# EAGLE design moja-row (EAGLE 6.4)
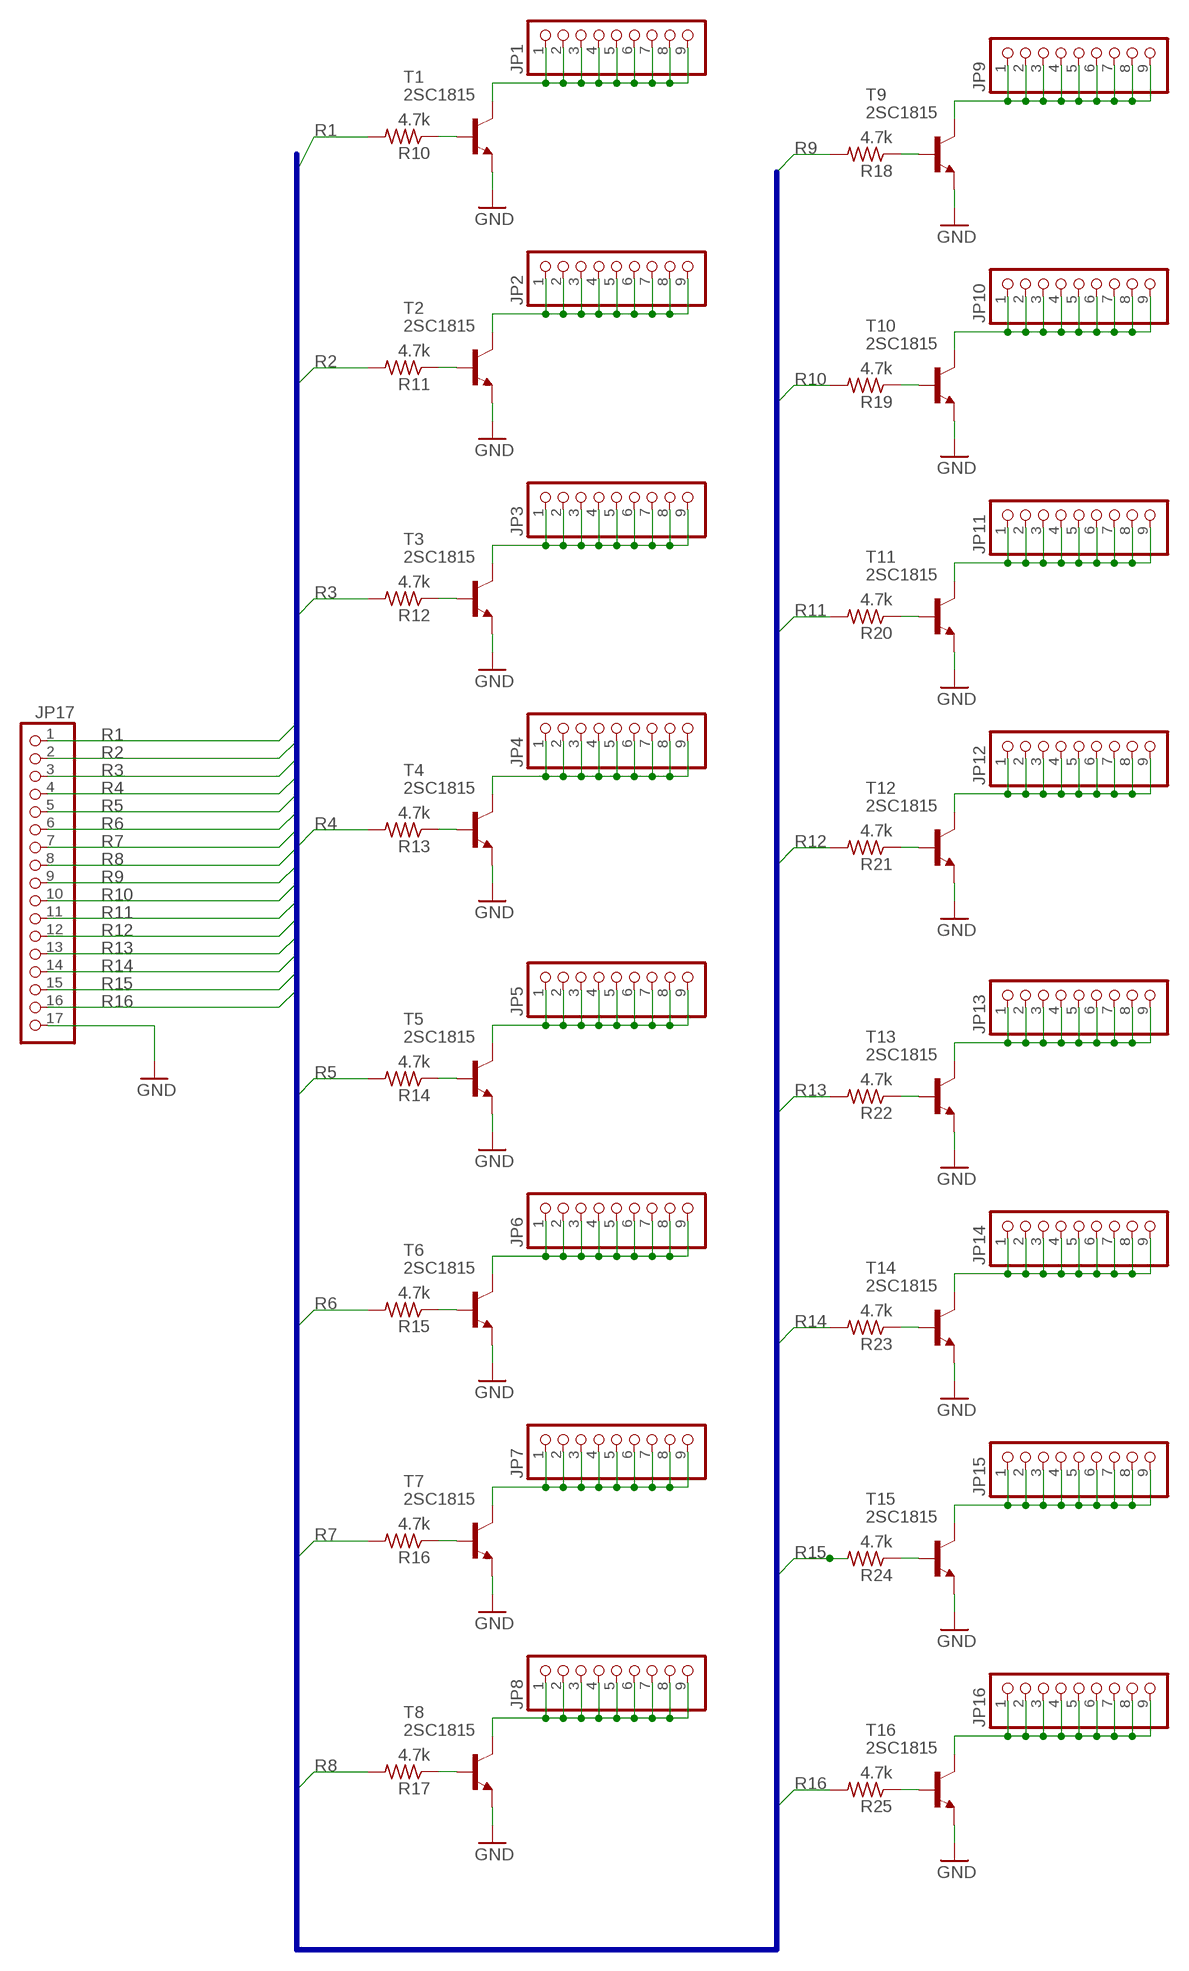
[diagram p0: schematic, sheet 1]

## Parts
JP1  PINHD-1X9  [1X09]
JP2  PINHD-1X9  [1X09]
JP3  PINHD-1X9  [1X09]
JP4  PINHD-1X9  [1X09]
JP5  PINHD-1X9  [1X09]
JP6  PINHD-1X9  [1X09]
JP7  PINHD-1X9  [1X09]
JP8  PINHD-1X9  [1X09]
JP9  PINHD-1X9  [1X09]
JP10  PINHD-1X9  [1X09]
JP11  PINHD-1X9  [1X09]
JP12  PINHD-1X9  [1X09]
JP13  PINHD-1X9  [1X09]
JP14  PINHD-1X9  [1X09]
JP15  PINHD-1X9  [1X09]
JP16  PINHD-1X9  [1X09]
JP17  PINHD-1X17  [1X17]
R10  4.7k  R-US_0204/2V  [0204V]
R11  4.7k  R-US_0204/2V  [0204V]
R12  4.7k  R-US_0204/2V  [0204V]
R13  4.7k  R-US_0204/2V  [0204V]
R14  4.7k  R-US_0204/2V  [0204V]
R15  4.7k  R-US_0204/2V  [0204V]
R16  4.7k  R-US_0204/2V  [0204V]
R17  4.7k  R-US_0204/2V  [0204V]
R18  4.7k  R-US_0204/2V  [0204V]
R19  4.7k  R-US_0204/2V  [0204V]
R20  4.7k  R-US_0204/2V  [0204V]
R21  4.7k  R-US_0204/2V  [0204V]
R22  4.7k  R-US_0204/2V  [0204V]
R23  4.7k  R-US_0204/2V  [0204V]
R24  4.7k  R-US_0204/2V  [0204V]
R25  4.7k  R-US_0204/2V  [0204V]
T1  2SC1815  [TO92-ECB]
T2  2SC1815  [TO92-ECB]
T3  2SC1815  [TO92-ECB]
T4  2SC1815  [TO92-ECB]
T5  2SC1815  [TO92-ECB]
T6  2SC1815  [TO92-ECB]
T7  2SC1815  [TO92-ECB]
T8  2SC1815  [TO92-ECB]
T9  2SC1815  [TO92-ECB]
T10  2SC1815  [TO92-ECB]
T11  2SC1815  [TO92-ECB]
T12  2SC1815  [TO92-ECB]
T13  2SC1815  [TO92-ECB]
T14  2SC1815  [TO92-ECB]
T15  2SC1815  [TO92-ECB]
T16  2SC1815  [TO92-ECB]

## Nets
GND: JP17.17 T1.E T2.E T3.E T4.E T5.E T6.E T7.E T8.E T9.E T10.E T11.E T12.E T13.E T14.E T15.E T16.E
N$19: JP1.1 JP1.2 JP1.3 JP1.4 JP1.5 JP1.6 JP1.7 JP1.8 JP1.9 T1.C
N$20: R10.1 T1.B
N$21: JP2.1 JP2.2 JP2.3 JP2.4 JP2.5 JP2.6 JP2.7 JP2.8 JP2.9 T2.C
N$22: R11.1 T2.B
N$23: JP3.1 JP3.2 JP3.3 JP3.4 JP3.5 JP3.6 JP3.7 JP3.8 JP3.9 T3.C
N$24: R12.1 T3.B
N$25: JP4.1 JP4.2 JP4.3 JP4.4 JP4.5 JP4.6 JP4.7 JP4.8 JP4.9 T4.C
N$26: R13.1 T4.B
N$27: JP5.1 JP5.2 JP5.3 JP5.4 JP5.5 JP5.6 JP5.7 JP5.8 JP5.9 T5.C
N$28: R14.1 T5.B
N$29: JP6.1 JP6.2 JP6.3 JP6.4 JP6.5 JP6.6 JP6.7 JP6.8 JP6.9 T6.C
N$30: R15.1 T6.B
N$31: JP7.1 JP7.2 JP7.3 JP7.4 JP7.5 JP7.6 JP7.7 JP7.8 JP7.9 T7.C
N$32: R16.1 T7.B
N$33: JP8.1 JP8.2 JP8.3 JP8.4 JP8.5 JP8.6 JP8.7 JP8.8 JP8.9 T8.C
N$34: R17.1 T8.B
N$35: JP9.1 JP9.2 JP9.3 JP9.4 JP9.5 JP9.6 JP9.7 JP9.8 JP9.9 T9.C
N$36: R18.1 T9.B
N$37: JP10.1 JP10.2 JP10.3 JP10.4 JP10.5 JP10.6 JP10.7 JP10.8 JP10.9 T10.C
N$38: R19.1 T10.B
N$39: JP11.1 JP11.2 JP11.3 JP11.4 JP11.5 JP11.6 JP11.7 JP11.8 JP11.9 T11.C
N$40: R20.1 T11.B
N$41: JP12.1 JP12.2 JP12.3 JP12.4 JP12.5 JP12.6 JP12.7 JP12.8 JP12.9 T12.C
N$42: R21.1 T12.B
N$43: JP13.1 JP13.2 JP13.3 JP13.4 JP13.5 JP13.6 JP13.7 JP13.8 JP13.9 T13.C
N$44: R22.1 T13.B
N$45: JP14.1 JP14.2 JP14.3 JP14.4 JP14.5 JP14.6 JP14.7 JP14.8 JP14.9 T14.C
N$46: R23.1 T14.B
N$47: JP15.1 JP15.2 JP15.3 JP15.4 JP15.5 JP15.6 JP15.7 JP15.8 JP15.9 T15.C
N$48: R24.1 T15.B
N$49: JP16.1 JP16.2 JP16.3 JP16.4 JP16.5 JP16.6 JP16.7 JP16.8 JP16.9 T16.C
N$50: R25.1 T16.B
R1: JP17.1 R10.2
R2: JP17.2 R11.2
R3: JP17.3 R12.2
R4: JP17.4 R13.2
R5: JP17.5 R14.2
R6: JP17.6 R15.2
R7: JP17.7 R16.2
R8: JP17.8 R17.2
R9: JP17.9 R18.2
R10: JP17.10 R19.2
R11: JP17.11 R20.2
R12: JP17.12 R21.2
R13: JP17.13 R22.2
R14: JP17.14 R23.2
R15: JP17.15 R24.2
R16: JP17.16 R25.2

## Buses
R[1..16]

## Library data of the parts
JP1-JP16 = pinhead:PINHD-1X9: PIN HEADER
JP17 = pinhead:PINHD-1X17: PIN HEADER
R10-R25 = resistor:R-US_: RESISTOR, American symbol
T1-T16 = transistor:2SC1815: NPN EPITAXIAL TRANSISTOR Source: TOSHIBA .. 2SC1815 1.pdf

## Board
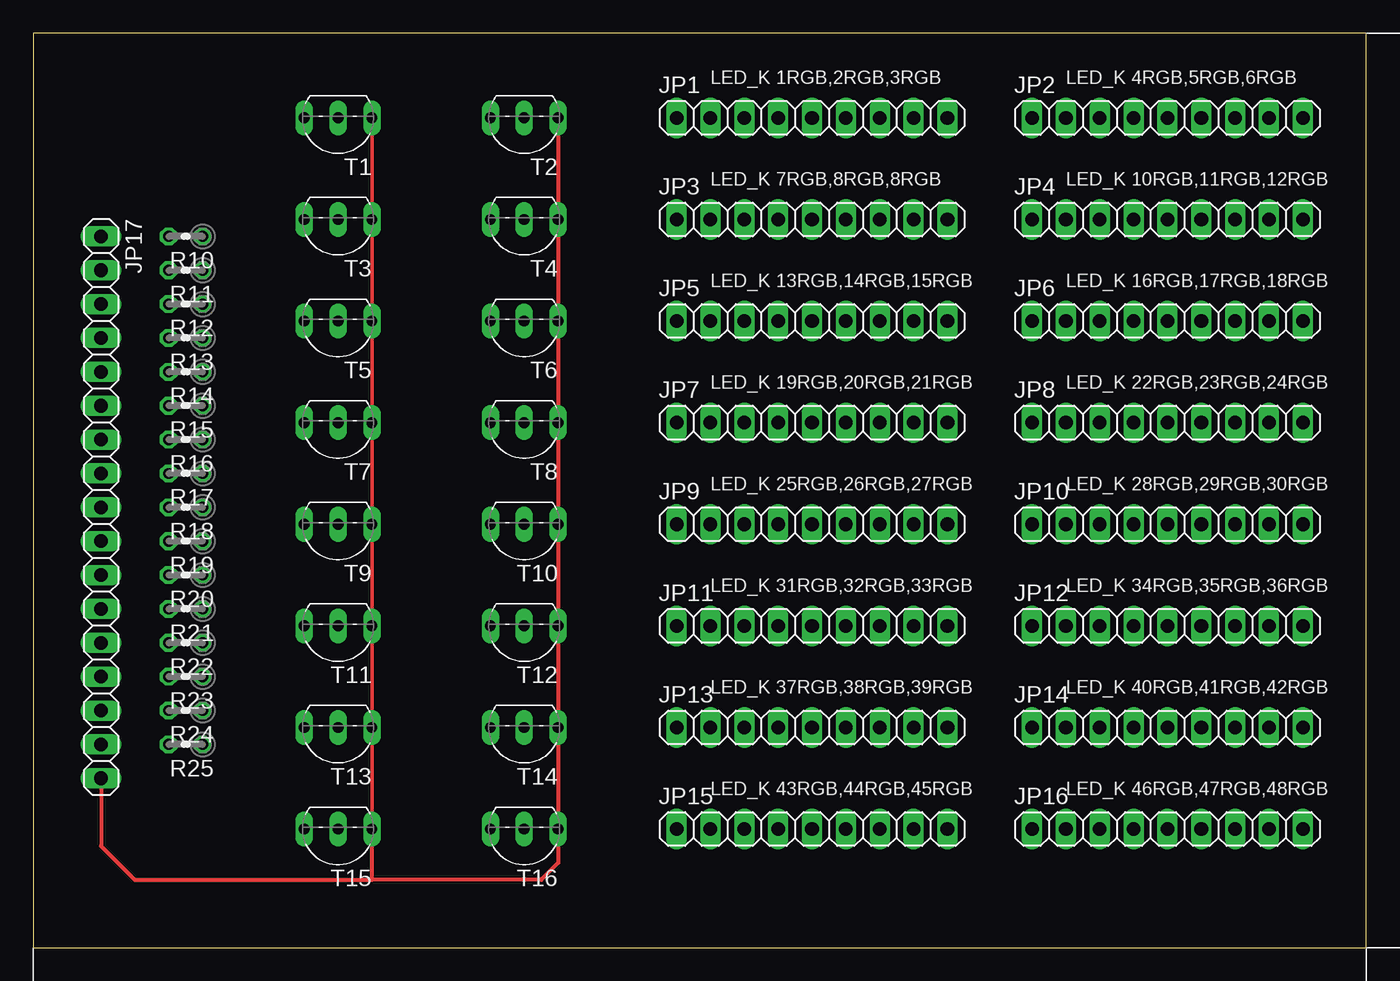
[diagram p1: board, top side]
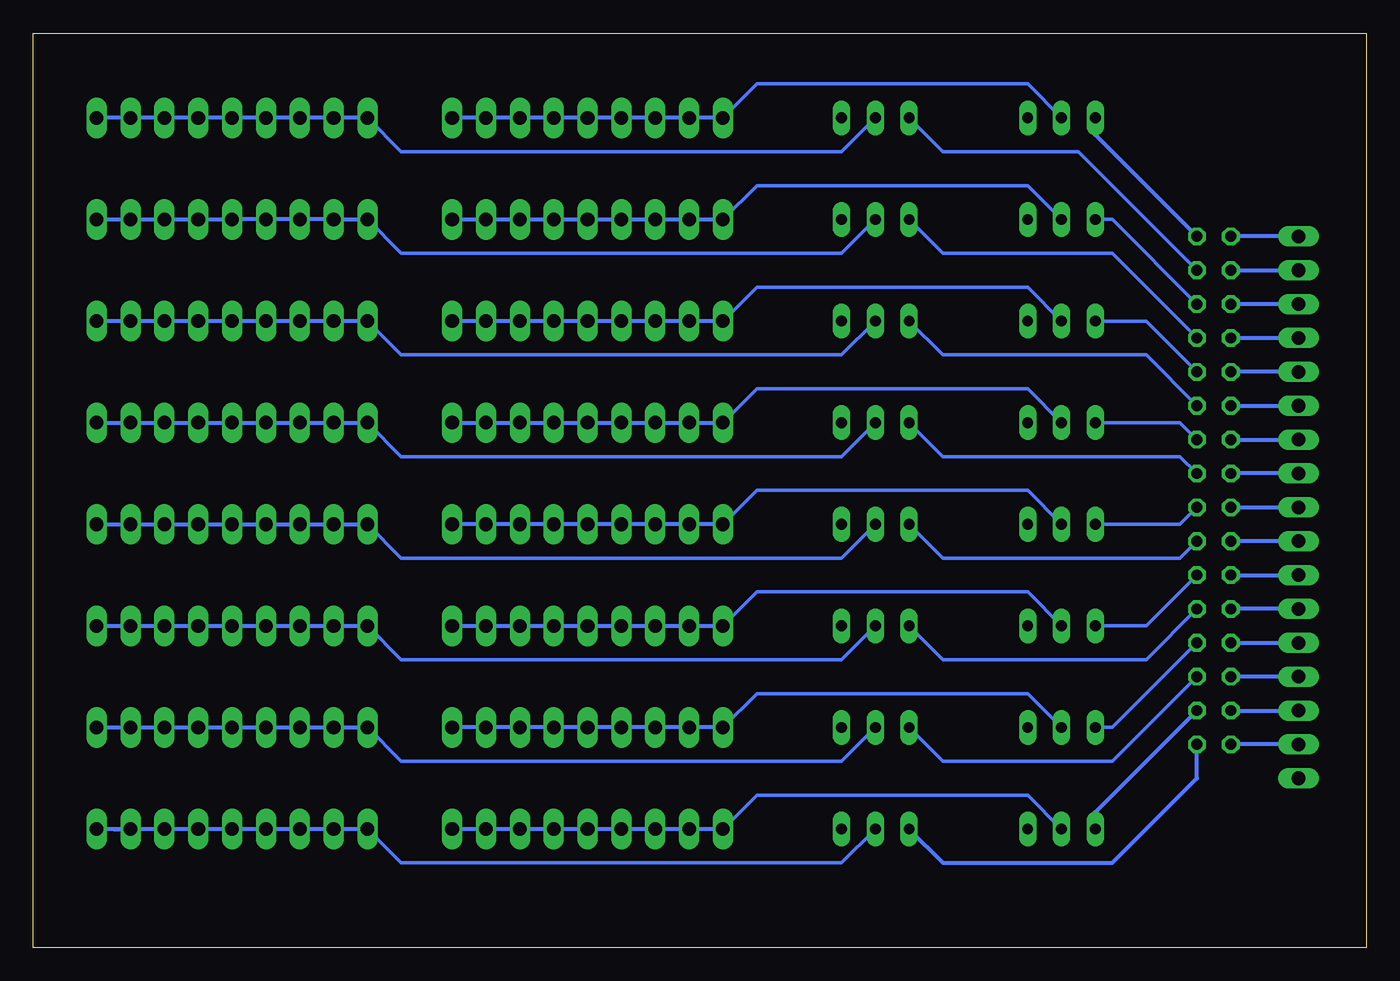
[diagram p2: board, bottom side, seen from below]

Size 100 x 68.57 mm. Coordinates in mm from the lower left corner, seen from the top.
Outline: 0,0 100,0 100,68.57 0,68.57 0,0
Copper layers (1*16): Top 0.035mm / dielectric 1.5mm / Bottom 0.035mm
Design rules "default": minimum track width 10mil, minimum drill 24mil, track to track 8mil, track to pad 8mil, pad to pad 8mil, via to via 8mil, smd to smd 8mil, copper to edge 40mil, drill to drill 8mil, minimum pad ring 10mil, minimum via ring 8mil, stop-mask expansion 4mil, vias tented up to drill 0mil, thermal gap 10mil

### Footprints (pad centres in the part's own frame; a part is rotated, then mirrored left to right if it is on the bottom)
1X09 = drill 1.016 long: 1 -10.16,0; 2 -7.62,0; 3 -5.08,0; 4 -2.54,0; 5 0,0; 6 2.54,0; 7 5.08,0; 8 7.62,0; 9 10.16,0
1X17 = drill 1.016 long: 1 -20.32,0; 2 -17.78,0; 3 -15.24,0; 4 -12.7,0; 5 -10.16,0; 6 -7.62,0; 7 -5.08,0; 8 -2.54,0; 9 0,0; 10 2.54,0; 11 5.08,0; 12 7.62,0; 13 10.16,0; 14 12.7,0; 15 15.24,0; 16 17.78,0; 17 20.32,0
0204V = drill 0.813 octagon: 1 -1.27,0; 2 1.27,0
TO92-ECB = drill 0.813 long: B 2.54,0; C 0,0; E -2.54,0

### Placement (x,y rotation side)
JP1  58.42,62.23 0 top
JP2  85.09,62.23 0 top
JP3  58.42,54.61 0 top
JP4  85.09,54.61 0 top
JP5  58.42,46.99 0 top
JP6  85.09,46.99 0 top
JP7  58.42,39.37 0 top
JP8  85.09,39.37 0 top
JP9  58.42,31.75 0 top
JP10  85.09,31.75 0 top
JP11  58.42,24.13 0 top
JP12  85.09,24.13 0 top
JP13  58.42,16.51 0 top
JP14  85.09,16.51 0 top
JP15  58.42,8.89 0 top
JP16  85.09,8.89 0 top
JP17  5.08,33.02 270 top
R10  11.43,53.34 180 top
R11  11.43,50.8 180 top
R12  11.43,48.26 180 top
R13  11.43,45.72 180 top
R14  11.43,43.18 180 top
R15  11.43,40.64 180 top
R16  11.43,38.1 180 top
R17  11.43,35.56 180 top
R18  11.43,33.02 180 top
R19  11.43,30.48 180 top
R20  11.43,27.94 180 top
R21  11.43,25.4 180 top
R22  11.43,22.86 180 top
R23  11.43,20.32 180 top
R24  11.43,17.78 180 top
R25  11.43,15.24 180 top
T1  22.86,62.23 180 top
T2  36.83,62.23 180 top
T3  22.86,54.61 180 top
T4  36.83,54.61 180 top
T5  22.86,46.99 180 top
T6  36.83,46.99 180 top
T7  22.86,39.37 180 top
T8  36.83,39.37 180 top
T9  22.86,31.75 180 top
T10  36.83,31.75 180 top
T11  22.86,24.13 180 top
T12  36.83,24.13 180 top
T13  22.86,16.51 180 top
T14  36.83,16.51 180 top
T15  22.86,8.89 180 top
T16  36.83,8.89 180 top

### Tracks (layer width: path | path; a pad name or v marks a point on that pad's centre or on a via)
GND
  Top 0.254: T2.E T4.E T6.E T8.E T10.E T12.E T14.E T16.E | T1.E T3.E T5.E T7.E T9.E T11.E T13.E T15.E
  Top 0.305: JP17.17 5.08,7.62 7.62,5.08 25.4,5.08 | 25.4,5.08 T15.E | T2.E 39.37,6.35 38.1,5.08 25.4,5.08
N$19
  Bottom 0.254: T1.C 25.4,64.77 45.72,64.77 JP1.1
  Bottom 0.305: JP1.1 JP1.2 JP1.3 JP1.4 JP1.5 JP1.6 JP1.7 JP1.8 JP1.9
N$20
  Bottom 0.305: R10.1 20.32,60.96 T1.B
N$21
  Bottom 0.254: T2.C 39.37,59.69 72.39,59.69 JP2.1
  Bottom 0.305: JP2.1 JP2.2 JP2.3 JP2.4 JP2.5 JP2.6 JP2.7 JP2.8 JP2.9
N$22
  Bottom 0.254: R11.1 21.59,59.69 31.75,59.69 T2.B
N$23
  Bottom 0.254: T3.C 25.4,57.15 45.72,57.15 JP3.1
  Bottom 0.305: JP3.9 JP3.8 JP3.7 JP3.6 JP3.5 JP3.4 JP3.3 JP3.2 JP3.1
N$24
  Bottom 0.254: R12.1 19.05,54.61 T3.B
N$25
  Bottom 0.254: T4.C 39.37,52.07 72.39,52.07 JP4.1
  Bottom 0.305: JP4.9 JP4.8 JP4.7 JP4.6 JP4.5 JP4.4 JP4.3 JP4.2 JP4.1
N$26
  Bottom 0.254: R13.1 19.05,52.07 31.75,52.07 T4.B
N$27
  Bottom 0.254: T5.C 25.4,49.53 45.72,49.53 JP5.1
  Bottom 0.305: JP5.1 JP5.2 JP5.3 JP5.4 JP5.5 JP5.6 JP5.7 JP5.8 JP5.9
N$28
  Bottom 0.254: R14.1 16.51,46.99 T5.B
N$29
  Bottom 0.254: T6.C 39.37,44.45 72.39,44.45 JP6.1
  Bottom 0.305: JP6.1 JP6.2 JP6.3 JP6.4 JP6.5 JP6.6 JP6.7 JP6.8 JP6.9
N$30
  Bottom 0.254: R15.1 16.51,44.45 31.75,44.45 T6.B
N$31
  Bottom 0.254: T7.C 25.4,41.91 45.72,41.91 JP7.1
  Bottom 0.305: JP7.9 JP7.8 JP7.7 JP7.6 JP7.5 JP7.4 JP7.3 JP7.2 JP7.1
N$32
  Bottom 0.254: R16.1 13.97,39.37 T7.B
N$33
  Bottom 0.254: T8.C 39.37,36.83 72.39,36.83 JP8.1
  Bottom 0.305: JP8.9 JP8.8 JP8.7 JP8.6 JP8.5 JP8.4 JP8.3 JP8.2 JP8.1
N$34
  Bottom 0.254: R17.1 13.97,36.83 31.75,36.83 T8.B
N$35
  Bottom 0.254: T9.C 25.4,34.29 45.72,34.29 JP9.1
  Bottom 0.305: JP9.1 JP9.2 JP9.3 JP9.4 JP9.5 JP9.6 JP9.7 JP9.8 JP9.9
N$36
  Bottom 0.254: R18.1 13.97,31.75 T9.B
N$37
  Bottom 0.254: T10.C 39.37,29.21 72.39,29.21 JP10.1
  Bottom 0.305: JP10.9 JP10.8 JP10.7 JP10.6 JP10.5 JP10.4 JP10.3 JP10.2 JP10.1
N$38
  Bottom 0.254: R19.1 13.97,29.21 31.75,29.21 T10.B
N$39
  Bottom 0.254: T11.C 25.4,26.67 45.72,26.67 JP11.1
  Bottom 0.305: JP11.9 JP11.8 JP11.7 JP11.6 JP11.5 JP11.4 JP11.3 JP11.2 JP11.1
N$40
  Bottom 0.254: R20.1 16.51,24.13 T11.B
N$41
  Bottom 0.254: T12.C 39.37,21.59 72.39,21.59 JP12.1
  Bottom 0.305: JP12.9 JP12.8 JP12.7 JP12.6 JP12.5 JP12.4 JP12.3 JP12.2 JP12.1
N$42
  Bottom 0.254: R21.1 16.51,21.59 31.75,21.59 T12.B
N$43
  Bottom 0.254: T13.C 25.4,19.05 45.72,19.05 JP13.1
  Bottom 0.305: JP13.1 JP13.2 JP13.3 JP13.4 JP13.5 JP13.6 JP13.7 JP13.8 JP13.9
N$44
  Bottom 0.254: R22.1 19.05,16.51 T13.B
N$45
  Bottom 0.254: T14.C 39.37,13.97 72.39,13.97 JP14.1
  Bottom 0.305: JP14.9 JP14.8 JP14.7 JP14.6 JP14.5 JP14.4 JP14.3 JP14.2 JP14.1
N$46
  Bottom 0.254: R23.1 19.05,13.97 31.75,13.97 T14.B
N$47
  Bottom 0.254: T15.C 25.4,11.43 45.72,11.43 JP15.1
  Bottom 0.305: JP15.1 JP15.2 JP15.3 JP15.4 JP15.5 JP15.6 JP15.7 JP15.8 JP15.9
N$48
  Bottom 0.305: R24.1 20.32,10.16 T15.B
N$49
  Bottom 0.254: T16.C 39.37,6.35 72.39,6.35 JP16.1
  Bottom 0.305: JP16.1 JP16.2 JP16.3 JP16.4 JP16.5 JP16.6 JP16.7 JP16.8 | 93.98,8.89 JP16.8 | JP16.8 JP16.9
N$50
  Bottom 0.305: T16.B 31.75,6.35 19.05,6.35 12.7,12.7 R25.1
R1
  Bottom 0.305: JP17.1 R10.2
R2
  Bottom 0.305: R11.2 JP17.2
R3
  Bottom 0.305: JP17.3 R12.2
R4
  Bottom 0.305: R13.2 JP17.4
R5
  Bottom 0.305: JP17.5 R14.2
R6
  Bottom 0.305: R15.2 JP17.6
R7
  Bottom 0.305: R16.2 JP17.7
R8
  Bottom 0.305: JP17.8 R17.2
R9
  Bottom 0.305: R18.2 JP17.9
R10
  Bottom 0.305: JP17.10 R19.2
R11
  Bottom 0.305: R20.2 JP17.11
R12
  Bottom 0.305: JP17.12 R21.2
R13
  Bottom 0.305: R22.2 JP17.13
R14
  Bottom 0.305: JP17.14 R23.2
R15
  Bottom 0.305: R24.2 JP17.15
R16
  Bottom 0.305: JP17.16 R25.2

### Text on the board
tPlace: LED_K 1RGB,2RGB,3RGB | LED_K 4RGB,5RGB,6RGB | LED_K 7RGB,8RGB,8RGB | LED_K 10RGB,11RGB,12RGB | LED_K 13RGB,14RGB,15RGB | LED_K 16RGB,17RGB,18RGB | LED_K 19RGB,20RGB,21RGB | LED_K 22RGB,23RGB,24RGB | LED_K 25RGB,26RGB,27RGB | LED_K 28RGB,29RGB,30RGB | LED_K 31RGB,32RGB,33RGB | LED_K 34RGB,35RGB,36RGB | LED_K 37RGB,38RGB,39RGB | LED_K 40RGB,41RGB,42RGB | LED_K 43RGB,44RGB,45RGB | LED_K 46RGB,47RGB,48RGB